# Altium schematic sheet [12] - IMX6_DDR3.SchDoc
size A2
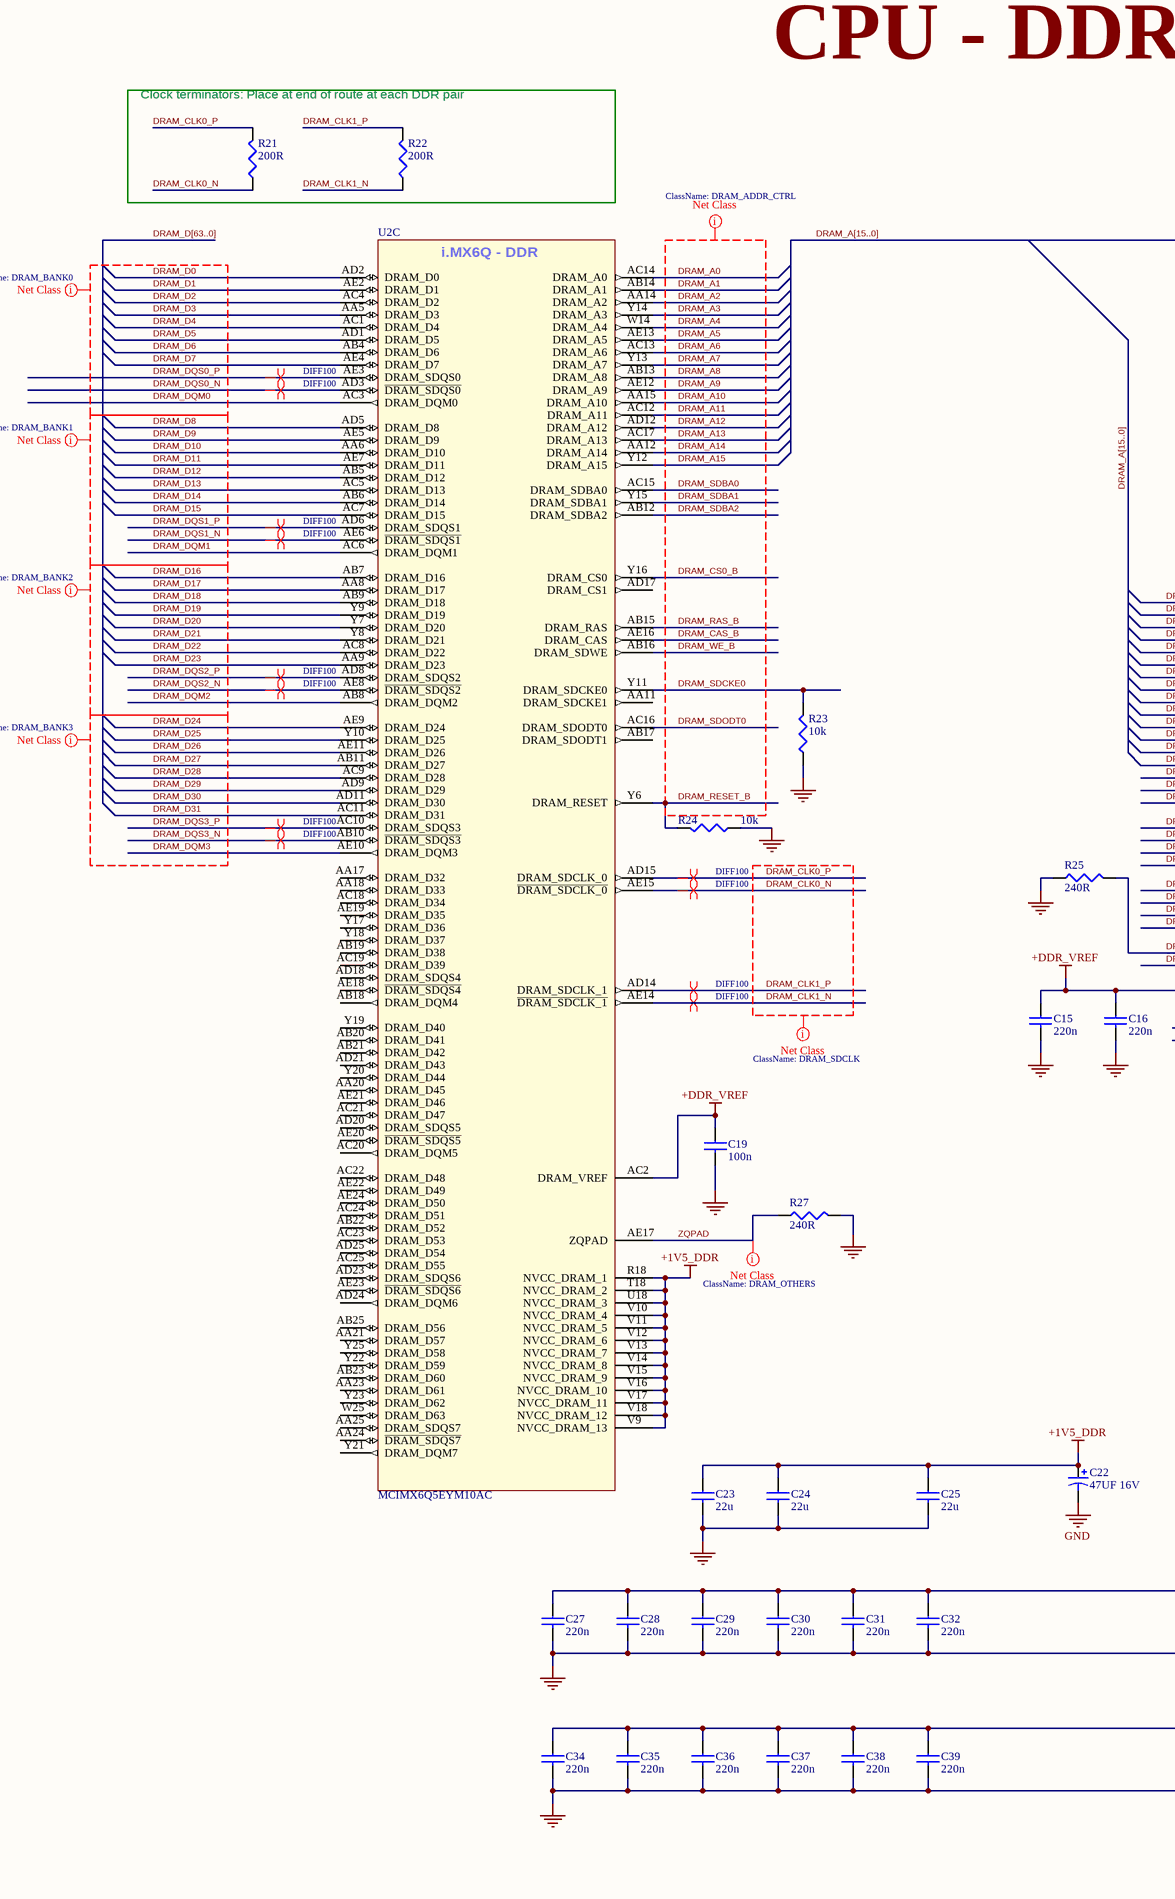
[diagram p0: [12] - IMX6_DDR3.SchDoc, left]
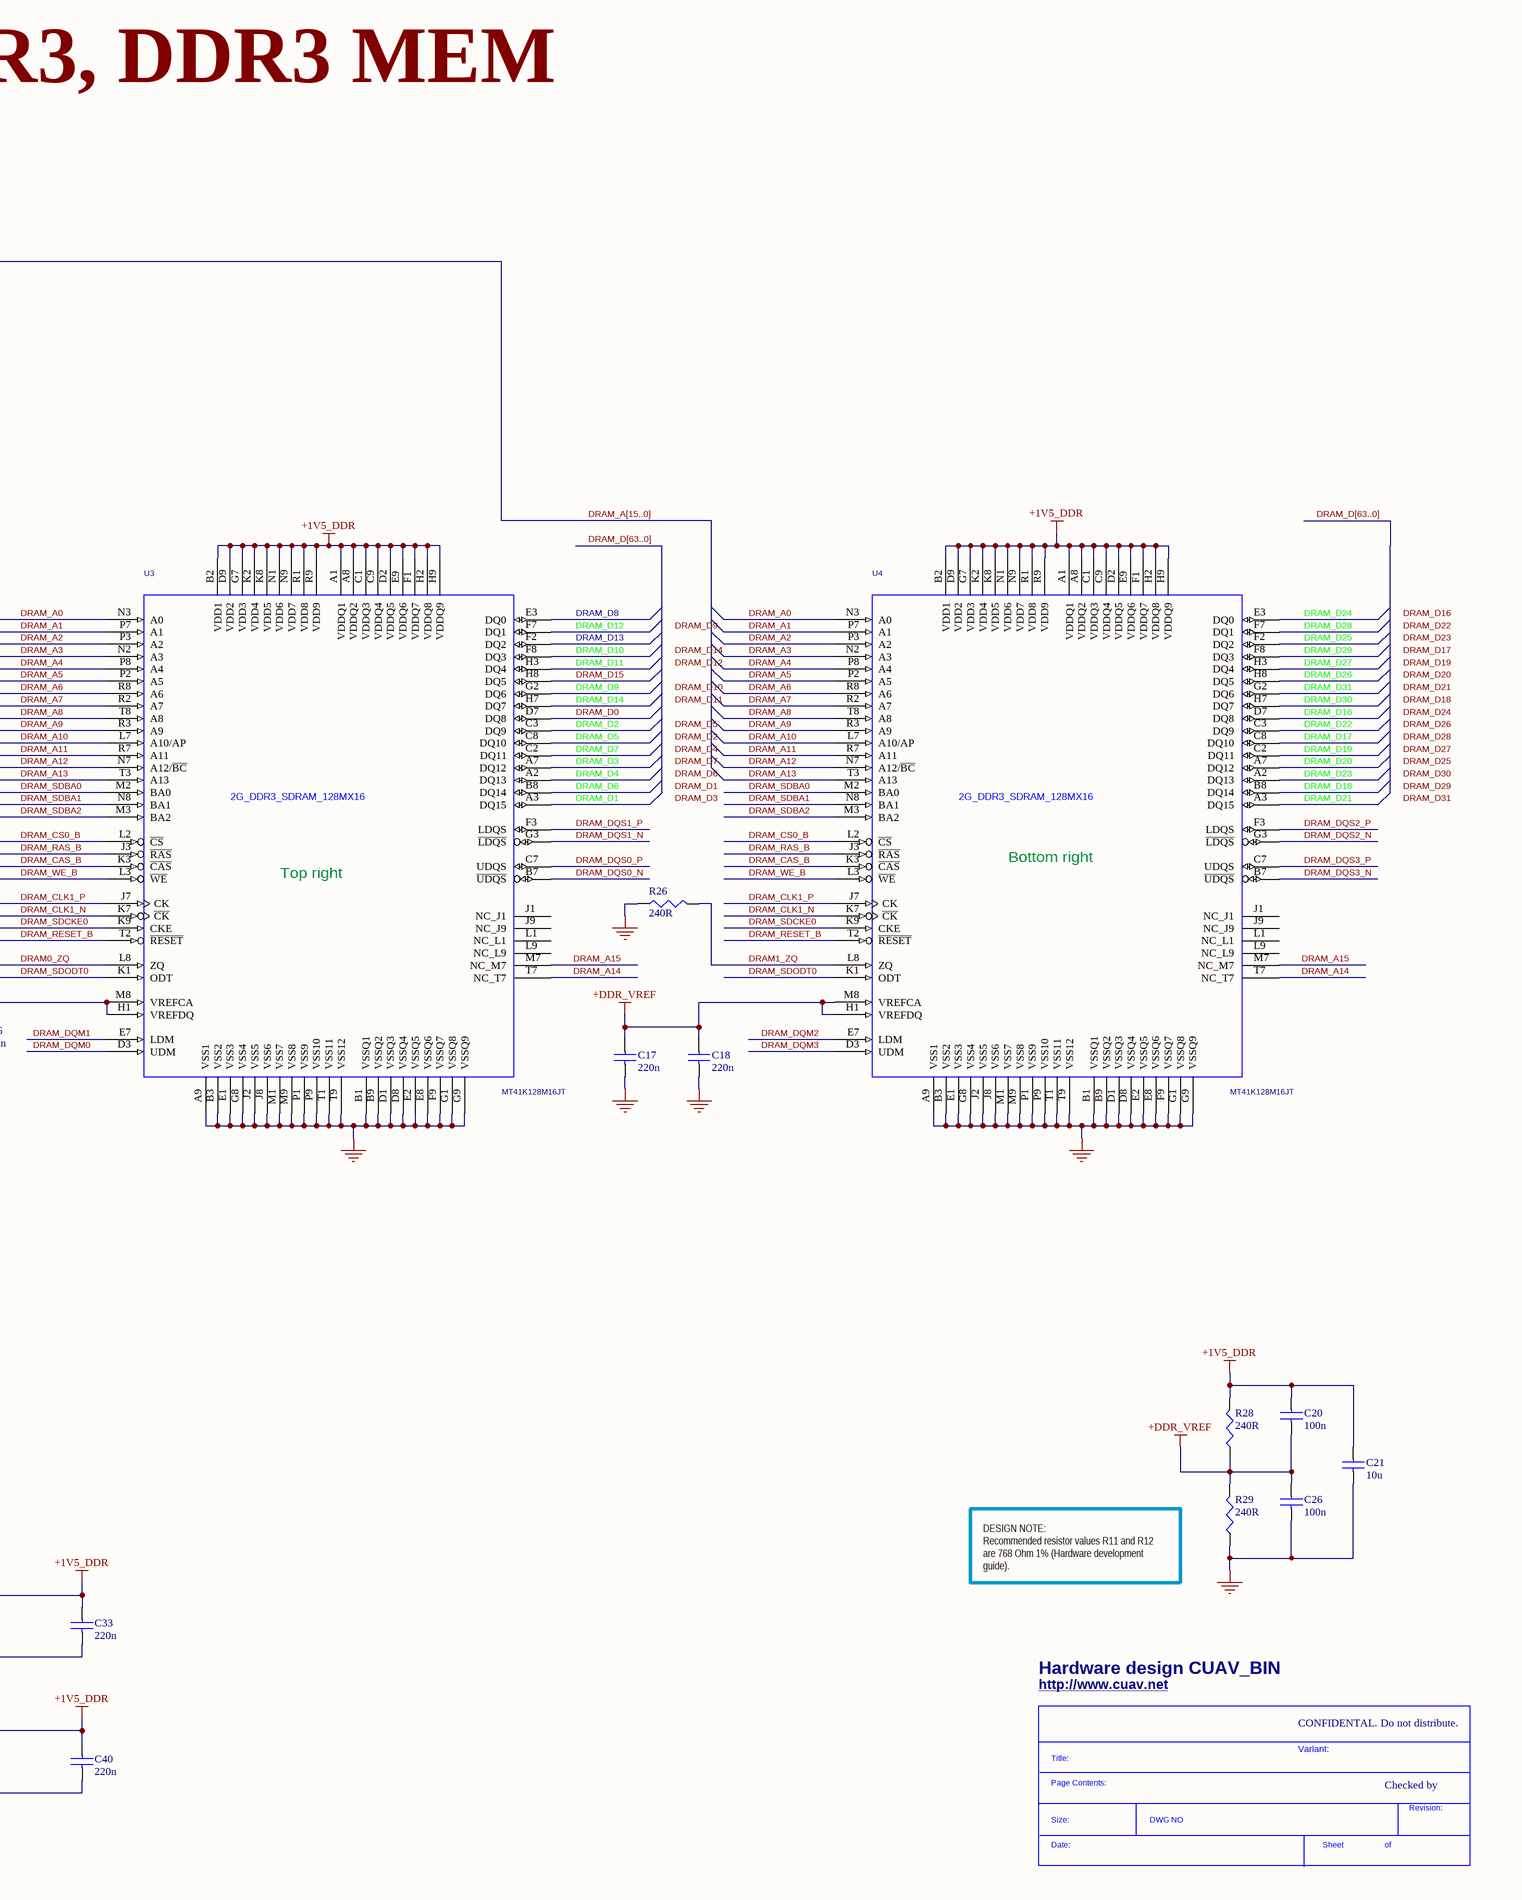
[diagram p1: [12] - IMX6_DDR3.SchDoc, right]

## Parts
*  SDTitleBlock  (value not drawn)  (graphical)
C15  220n  [0402CAP]
C16  220n  [0402CAP]
C17  220n  [0402CAP]
C18  220n  [0402CAP]
C19  100n  [C0402]
C20  100n  [0402CAP]
C21  10u  [C0603]
C22  47UF 16V  [7343CAP]
C23  22u  [C0603]
C24  22u  [C0603]
C25  22u  [C0603]
C26  100n  [0402CAP]
C27  220n  [0402CAP]
C28  220n  [0402CAP]
C29  220n  [0402CAP]
C30  220n  [0402CAP]
C31  220n  [0402CAP]
C32  220n  [0402CAP]
C33  220n  [0402CAP]
C34  220n  [0402CAP]
C35  220n  [0402CAP]
C36  220n  [0402CAP]
C37  220n  [0402CAP]
C38  220n  [0402CAP]
C39  220n  [0402CAP]
C40  220n  [0402CAP]
R21  200R  [R0402]
R22  200R  [R0402]
R23  10k  [R0402]
R24  10k  [R0402]
R25  240R  [R0402]
R26  240R  [R0402]
R27  240R  [R0402]
R28  240R  [R0402]
R29  240R  [R0402]
U2  MCIMX6Q5EYM10AC  [PBGA624]  (part C of 15)
U3  MT41K128M16JT  [96_FPGA_DD3]
U4  MT41K128M16JT  [96_FPGA_DD3]

## Blocks framed on the sheet
Clock terminators: Place at end of route at each DDR pair: R21 R22

## Nets
+1V5_DDR: C20.1 C21.1 C22.A C23.1 C24.1 C25.1 C27.1 C28.1 C29.1 C30.1 C31.1 C32.1 C33.1 C34.1 C35.1 C36.1 C37.1 C38.1 C39.1 C40.1 R28.2 U2.R18(NVCC_DRAM_1) U2.T18(NVCC_DRAM_2) U2.U18(NVCC_DRAM_3) U2.V9(NVCC_DRAM_13) U2.V10(NVCC_DRAM_4) U2.V11(NVCC_DRAM_5) U2.V12(NVCC_DRAM_6) U2.V13(NVCC_DRAM_7) U2.V14(NVCC_DRAM_8) U2.V15(NVCC_DRAM_9) U2.V16(NVCC_DRAM_10) U2.V17(NVCC_DRAM_11) U2.V18(NVCC_DRAM_12) U3.A1(VDDQ1) U3.A8(VDDQ2) U3.B2(VDD1) U3.C1(VDDQ3) U3.C9(VDDQ4) U3.D2(VDDQ5) U3.D9(VDD2) U3.E9(VDDQ6) U3.F1(VDDQ7) U3.G7(VDD3) U3.H2(VDDQ8) U3.H9(VDDQ9) U3.K2(VDD4) U3.K8(VDD5) U3.N1(VDD6) U3.N9(VDD7) U3.R1(VDD8) U3.R9(VDD9) U4.A1(VDDQ1) U4.A8(VDDQ2) U4.B2(VDD1) U4.C1(VDDQ3) U4.C9(VDDQ4) U4.D2(VDDQ5) U4.D9(VDD2) U4.E9(VDDQ6) U4.F1(VDDQ7) U4.G7(VDD3) U4.H2(VDDQ8) U4.H9(VDDQ9) U4.K2(VDD4) U4.K8(VDD5) U4.N1(VDD6) U4.N9(VDD7) U4.R1(VDD8) U4.R9(VDD9)
+DDR_VREF: C15.1 C16.1 C17.1 C18.1 C19.1 C20.2 C26.1 R28.1 R29.2 U2.AC2(DRAM_VREF) U3.H1(VREFDQ) U3.M8(VREFCA) U4.H1(VREFDQ) U4.M8(VREFCA)
GND: C15.2 C16.2 C17.2 C18.2 C19.2 C21.2 C22.C C23.2 C24.2 C25.2 C26.2 C27.2 C28.2 C29.2 C30.2 C31.2 C32.2 C33.2 C34.2 C35.2 C36.2 C37.2 C38.2 C39.2 C40.2 R23.1 R24.1 R25.1 R26.1 R27.2 R29.1 U3.A9(VSS1) U3.B1(VSSQ1) U3.B3(VSS2) U3.B9(VSSQ2) U3.D1(VSSQ3) U3.D8(VSSQ4) U3.E1(VSS3) U3.E2(VSSQ5) U3.E8(VSSQ6) U3.F9(VSSQ7) U3.G1(VSSQ8) U3.G8(VSS4) U3.G9(VSSQ9) U3.J2(VSS5) U3.J8(VSS6) U3.M1(VSS7) U3.M9(VSS8) U3.P1(VSS9) U3.P9(VSS10) U3.T1(VSS11) U3.T9(VSS12) U4.A9(VSS1) U4.B1(VSSQ1) U4.B3(VSS2) U4.B9(VSSQ2) U4.D1(VSSQ3) U4.D8(VSSQ4) U4.E1(VSS3) U4.E2(VSSQ5) U4.E8(VSSQ6) U4.F9(VSSQ7) U4.G1(VSSQ8) U4.G8(VSS4) U4.G9(VSSQ9) U4.J2(VSS5) U4.J8(VSS6) U4.M1(VSS7) U4.M9(VSS8) U4.P1(VSS9) U4.P9(VSS10) U4.T1(VSS11) U4.T9(VSS12)
DRAM0_ZQ: R25.2 U3.L8(ZQ)
DRAM1_ZQ: R26.2 U4.L8(ZQ)
DRAM_A0: U2.AC14(DRAM_A0) U3.N3(A0) U4.N3(A0)
DRAM_A1: U2.AB14(DRAM_A1) U3.P7(A1) U4.P7(A1)
DRAM_A2: U2.AA14(DRAM_A2) U3.P3(A2) U4.P3(A2)
DRAM_A3: U2.Y14(DRAM_A3) U3.N2(A3) U4.N2(A3)
DRAM_A4: U2.W14(DRAM_A4) U3.P8(A4) U4.P8(A4)
DRAM_A5: U2.AE13(DRAM_A5) U3.P2(A5) U4.P2(A5)
DRAM_A6: U2.AC13(DRAM_A6) U3.R8(A6) U4.R8(A6)
DRAM_A7: U2.Y13(DRAM_A7) U3.R2(A7) U4.R2(A7)
DRAM_A8: U2.AB13(DRAM_A8) U3.T8(A8) U4.T8(A8)
DRAM_A9: U2.AE12(DRAM_A9) U3.R3(A9) U4.R3(A9)
DRAM_A10: U2.AA15(DRAM_A10) U3.L7(A10/AP) U4.L7(A10/AP)
DRAM_A11: U2.AC12(DRAM_A11) U3.R7(A11) U4.R7(A11)
DRAM_A12: U2.AD12(DRAM_A12) U3.N7(A12/~{BC}) U4.N7(A12/~{BC})
DRAM_A13: U2.AC17(DRAM_A13) U3.T3(A13) U4.T3(A13)
DRAM_A14: U2.AA12(DRAM_A14) U3.T7(NC_T7) U4.T7(NC_T7)
DRAM_A15: U2.Y12(DRAM_A15) U3.M7(NC_M7) U4.M7(NC_M7)
DRAM_CAS_B: U2.AE16(DRAM_CAS) U3.K3(~{CAS}) U4.K3(~{CAS})
DRAM_CLK0_N: R21.1 U2.AE15(~{DRAM_SDCLK_0})
DRAM_CLK0_P: R21.2 U2.AD15(DRAM_SDCLK_0)
DRAM_CLK1_N: R22.1 U2.AE14(~{DRAM_SDCLK_1}) U3.K7(~{CK}) U4.K7(~{CK})
DRAM_CLK1_P: R22.2 U2.AD14(DRAM_SDCLK_1) U3.J7(CK) U4.J7(CK)
DRAM_CS0_B: U2.Y16(DRAM_CS0) U3.L2(~{CS}) U4.L2(~{CS})
DRAM_D0: U2.AD2(DRAM_D0) U3.D7(DQ8)
DRAM_D1: U2.AE2(DRAM_D1) U3.A3(DQ15)
DRAM_D2: U2.AC4(DRAM_D2) U3.C3(DQ9)
DRAM_D3: U2.AA5(DRAM_D3) U3.A7(DQ12)
DRAM_D4: U2.AC1(DRAM_D4) U3.A2(DQ13)
DRAM_D5: U2.AD1(DRAM_D5) U3.C8(DQ10)
DRAM_D6: U2.AB4(DRAM_D6) U3.B8(DQ14)
DRAM_D7: U2.AE4(DRAM_D7) U3.C2(DQ11)
DRAM_D8: U2.AD5(DRAM_D8) U3.E3(DQ0)
DRAM_D9: U2.AE5(DRAM_D9) U3.G2(DQ6)
DRAM_D10: U2.AA6(DRAM_D10) U3.F8(DQ3)
DRAM_D11: U2.AE7(DRAM_D11) U3.H3(DQ4)
DRAM_D12: U2.AB5(DRAM_D12) U3.F7(DQ1)
DRAM_D13: U2.AC5(DRAM_D13) U3.F2(DQ2)
DRAM_D14: U2.AB6(DRAM_D14) U3.H7(DQ7)
DRAM_D15: U2.AC7(DRAM_D15) U3.H8(DQ5)
DRAM_D16: U2.AB7(DRAM_D16) U4.D7(DQ8)
DRAM_D17: U2.AA8(DRAM_D17) U4.C8(DQ10)
DRAM_D18: U2.AB9(DRAM_D18) U4.B8(DQ14)
DRAM_D19: U2.Y9(DRAM_D19) U4.C2(DQ11)
DRAM_D20: U2.Y7(DRAM_D20) U4.A7(DQ12)
DRAM_D21: U2.Y8(DRAM_D21) U4.A3(DQ15)
DRAM_D22: U2.AC8(DRAM_D22) U4.C3(DQ9)
DRAM_D23: U2.AA9(DRAM_D23) U4.A2(DQ13)
DRAM_D24: U2.AE9(DRAM_D24) U4.E3(DQ0)
DRAM_D25: U2.Y10(DRAM_D25) U4.F2(DQ2)
DRAM_D26: U2.AE11(DRAM_D26) U4.H8(DQ5)
DRAM_D27: U2.AB11(DRAM_D27) U4.H3(DQ4)
DRAM_D28: U2.AC9(DRAM_D28) U4.F7(DQ1)
DRAM_D29: U2.AD9(DRAM_D29) U4.F8(DQ3)
DRAM_D30: U2.AD11(DRAM_D30) U4.H7(DQ7)
DRAM_D31: U2.AC11(DRAM_D31) U4.G2(DQ6)
DRAM_DQM0: U2.AC3(DRAM_DQM0) U3.D3(UDM)
DRAM_DQM1: U2.AC6(DRAM_DQM1) U3.E7(LDM)
DRAM_DQM2: U2.AB8(DRAM_DQM2) U4.E7(LDM)
DRAM_DQM3: U2.AE10(DRAM_DQM3) U4.D3(UDM)
DRAM_DQS0_N: U2.AD3(~{DRAM_SDQS0}) U3.B7(~{UDQS})
DRAM_DQS0_P: U2.AE3(DRAM_SDQS0) U3.C7(UDQS)
DRAM_DQS1_N: U2.AE6(~{DRAM_SDQS1}) U3.G3(~{LDQS})
DRAM_DQS1_P: U2.AD6(DRAM_SDQS1) U3.F3(LDQS)
DRAM_DQS2_N: U2.AE8(~{DRAM_SDQS2}) U4.G3(~{LDQS})
DRAM_DQS2_P: U2.AD8(DRAM_SDQS2) U4.F3(LDQS)
DRAM_DQS3_N: U2.AB10(~{DRAM_SDQS3}) U4.B7(~{UDQS})
DRAM_DQS3_P: U2.AC10(DRAM_SDQS3) U4.C7(UDQS)
DRAM_RAS_B: U2.AB15(DRAM_RAS) U3.J3(~{RAS}) U4.J3(~{RAS})
DRAM_RESET_B: R24.2 U2.Y6(DRAM_RESET) U3.T2(~{RESET}) U4.T2(~{RESET})
DRAM_SDBA0: U2.AC15(DRAM_SDBA0) U3.M2(BA0) U4.M2(BA0)
DRAM_SDBA1: U2.Y15(DRAM_SDBA1) U3.N8(BA1) U4.N8(BA1)
DRAM_SDBA2: U2.AB12(DRAM_SDBA2) U3.M3(BA2) U4.M3(BA2)
DRAM_SDCKE0: R23.2 U2.Y11(DRAM_SDCKE0) U3.K9(CKE) U4.K9(CKE)
DRAM_SDODT0: U2.AC16(DRAM_SDODT0) U3.K1(ODT) U4.K1(ODT)
DRAM_WE_B: U2.AB16(DRAM_SDWE) U3.L3(~{WE}) U4.L3(~{WE})
ZQPAD: R27.1 U2.AE17(ZQPAD)

Not connected (* = marked no-connect by the designer): U2 AA11(DRAM_SDCKE1) AA17(DRAM_D32) AA18(DRAM_D33) AA20(DRAM_D45) AA21(DRAM_D57) AA23(DRAM_D61) AA24(~{DRAM_SDQS7}) AA25(DRAM_SDQS7) AB17(DRAM_SDODT1) AB18(DRAM_DQM4) AB19(DRAM_D38) AB20(DRAM_D41) AB21(DRAM_D42) AB22(DRAM_D52) AB23(DRAM_D60) AB25(DRAM_D56) AC18(DRAM_D34) AC19(DRAM_D39) AC20(DRAM_DQM5) AC21(DRAM_D47) AC22(DRAM_D48) AC23(DRAM_D53) AC24(DRAM_D51) AC25(DRAM_D55) AD17(DRAM_CS1) AD18(DRAM_SDQS4) AD20(DRAM_SDQS5) AD21(DRAM_D43) AD23(DRAM_SDQS6) AD24(DRAM_DQM6) AD25(DRAM_D54) AE18(~{DRAM_SDQS4}) AE19(DRAM_D35) AE20(~{DRAM_SDQS5}) AE21(DRAM_D46) AE22(DRAM_D49) AE23(~{DRAM_SDQS6}) AE24(DRAM_D50) W25(DRAM_D63) Y17(DRAM_D36) Y18(DRAM_D37) Y19(DRAM_D40) Y20(DRAM_D44) Y21(DRAM_DQM7) Y22(DRAM_D59) Y23(DRAM_D62) Y25(DRAM_D58); U3 J1(NC_J1) J9(NC_J9) L1(NC_L1) L9(NC_L9); U4 J1(NC_J1) J9(NC_J9) L1(NC_L1) L9(NC_L9)

## Buses and harness runs
bus DRAM_A[15..0]
bus DRAM_D[63..0]

## Layout directives
net class DRAM_BANK0: DRAM_D0, DRAM_D1, DRAM_D2, DRAM_D3, DRAM_D4, DRAM_D5, DRAM_D6, DRAM_D7, DRAM_DQM0, DRAM_DQS0_N, DRAM_DQS0_P
net class DRAM_BANK1: DRAM_D8, DRAM_D9, DRAM_D10, DRAM_D11, DRAM_D12, DRAM_D13, DRAM_D14, DRAM_D15, DRAM_DQM1, DRAM_DQS1_N, DRAM_DQS1_P
net class DRAM_BANK2: DRAM_D16, DRAM_D17, DRAM_D18, DRAM_D19, DRAM_D20, DRAM_D21, DRAM_D22, DRAM_D23, DRAM_DQM2, DRAM_DQS2_N, DRAM_DQS2_P
net class DRAM_BANK3: DRAM_D24, DRAM_D25, DRAM_D26, DRAM_D27, DRAM_D28, DRAM_D29, DRAM_D30, DRAM_D31, DRAM_DQM3, DRAM_DQS3_N, DRAM_DQS3_P
differential pair; net class DIFF100: DRAM_CLK0_N, DRAM_CLK0_P, DRAM_CLK1_N, DRAM_CLK1_P, DRAM_DQS0_N, DRAM_DQS0_P, DRAM_DQS1_N, DRAM_DQS1_P, DRAM_DQS2_N, DRAM_DQS2_P, DRAM_DQS3_N, DRAM_DQS3_P
net class DRAM_ADDR_CTRL: DRAM_A0, DRAM_A1, DRAM_A2, DRAM_A3, DRAM_A4, DRAM_A5, DRAM_A6, DRAM_A7, DRAM_A8, DRAM_A9, DRAM_A10, DRAM_A11, DRAM_A12, DRAM_A13, DRAM_A14, DRAM_A15, DRAM_CAS_B, DRAM_CS0_B, DRAM_RAS_B, DRAM_RESET_B, DRAM_SDBA0, DRAM_SDBA1, DRAM_SDBA2, DRAM_SDCKE0, DRAM_SDODT0, DRAM_WE_B
net class DRAM_SDCLK: DRAM_CLK0_N, DRAM_CLK0_P, DRAM_CLK1_N, DRAM_CLK1_P
net class DRAM_OTHERS: ZQPAD

## Notes on the sheet
- CPU - DDR3, DDR3 MEM
- (near U3) Top right
- (near U4) Bottom right
- DESIGN NOTE:
  Recommended resistor values R11 and R12 are 768 Ohm 1% (Hardware development guide).
- (near *) Hardware design CUAV_BIN
- (near *) http://www.cuav.net
- CONFIDENTAL. Do not distribute.
- Variant:
- Checked by
- Labels drawn without touching a wire or pin: DRAM_D1, DRAM_D2, DRAM_D3, DRAM_D4, DRAM_D5, DRAM_D6, DRAM_D7, DRAM_D9, DRAM_D10, DRAM_D11, DRAM_D12, DRAM_D14, DRAM_D16, DRAM_D17, DRAM_D18, DRAM_D19, DRAM_D20, DRAM_D21, DRAM_D22, DRAM_D23, DRAM_D24, DRAM_D25, DRAM_D26, DRAM_D27, DRAM_D28, DRAM_D29, DRAM_D30, DRAM_D31
- (in symbol 2G_DDR3_SDRAM_128MX16_96P) 2G_DDR3_SDRAM_128MX16
- (in symbol MCIMX6Q5EYM10AC, part C) i.MX6Q - DDR
- (in symbol SDTitleBlock) Title:; Page Contents:; Revision:; Size:; DWG NO; Date:; Sheet; of

## Library data of the parts
C15-C18 C27-C40 = C1005X5R1E224M: CAP CER .22UF 25V X5R 20% 0402; Manufacturer: TDK Corporation; Capacitance: 0.22礔; Value: 220nF; .Checked PCB: used; Tolerance: ?0%; Category: Capacitors; Supplier Part Number: 445-5945-1-ND; Manufacturer Part Number: C1005X5R1E224M; Operating Temperature: -55癈 ~ 85癈; Package / Case: 0402 (1005 Metric); Price 1k [$]: 0.02600; .Checked SCH: used; Voltage - Rated: 25V; Supplier: Digikey; Supplier 1: Digi-Key; Supplier Part Number 1: 445-5945-1-ND; RoHS: RoHS Compliant; Stock 1: 54593; Pricing 1: 1=0.3, 10=0.2, 100=0.08, 250=0.05752, 500=0.041, 1000=0.03 (USD); Temperature Coefficient: X5R; Mounting Type: Surface Mount, MLCC; Applications: General Purpose; Ratings: -; Size / Dimension: 0.039" L x 0.020" W (1.00mm x 0.50mm); Height - Seated (Max): -; Thickness (Max): 0.022" (0.55mm); Lead Spacing: -; Features: -; Packaging: Cut Tape (CT); Lead Style: -; ComponentLink1URL: http://www.tdk.co.jp/tefe02/e412_c.pdf; ComponentLink1Description: http://www.tdk.co.jp/tefe02/e412_c.pdf
C19 C20 C26 = C1005X5R1H104K: CAP CER .10UF 50V X5R 10% 0402; Manufacturer: TDK Corporation; Capacitance: 0.1礔; Value: 100nF; .Checked PCB: used; Tolerance: ?0%; Category: Capacitors; Supplier Part Number: 445-5942-1-ND; Manufacturer Part Number: C1005X5R1H104K; Operating Temperature: -55癈 ~ 85癈; Package / Case: 0402 (1005 Metric); Price 1k [$]: 0.02340; .Checked SCH: used; Voltage - Rated: 50V; Supplier: Digikey; Supplier 1: Digi-Key; Supplier Part Number 1: 445-5942-1-ND; RoHS: RoHS Compliant; Stock 1: 106926; Pricing 1: 1=0.27, 10=0.18, 100=0.072, 250=0.05176, 500=0.0369, 1000=0.027 (USD); Temperature Coefficient: X5R; Mounting Type: Surface Mount, MLCC; Applications: General Purpose; Ratings: -; Size / Dimension: 0.039" L x 0.020" W (1.00mm x 0.50mm); Height - Seated (Max): -; Thickness (Max): 0.022" (0.55mm); Lead Spacing: -; Features: -; Packaging: Cut Tape (CT); Lead Style: -; ComponentLink1URL: http://www.tdk.co.jp/tefe02/e412_c.pdf; ComponentLink1Description: http://www.tdk.co.jp/tefe02/e412_c.pdf
C21 = C1608X5R0J106M: CAP CER 10UF 6.3V X5R 20% 0603; Manufacturer: TDK Corporation; Capacitance: 10礔; Value: 10礔; .Checked PCB: used; Tolerance: ?0%; Category: Capacitors; Supplier Part Number: 445-4112-1-ND; Manufacturer Part Number: C1608X5R0J106M; Operating Temperature: -55癈 ~ 85癈; Package / Case: 0603 (1608 Metric); Price 1k [$]: 0.08580; .Checked SCH: used; Voltage - Rated: 6.3V; Features: Low ESR; Supplier: Digikey; Supplier 1: Digi-Key; Supplier Part Number 1: 445-4112-1-ND; RoHS: RoHS Compliant; Stock 1: 48157; Pricing 1: 1=0.46, 10=0.363, 100=0.1898, 250=0.14024, 500=0.1089, 1000=0.0858 (USD); Temperature Coefficient: X5R; Mounting Type: Surface Mount, MLCC; Applications: General Purpose; Ratings: -; Size / Dimension: 0.063" L x 0.031" W (1.60mm x 0.80mm); Height - Seated (Max): -; Thickness (Max): 0.037" (0.95mm); Lead Spacing: -; Packaging: Cut Tape (CT); Lead Style: -; ComponentLink1URL: http://www.tdk.com/pdf/general_B11.pdf; ComponentLink1Description: http://www.tdk.com/pdf/general_B11.pdf
C22 = Cap Pol1: Polarized Capacitor (Radial); Value: 100pF; Published: 8-Jun-2000; LatestRevisionDate: 17-Jul-2002; LatestRevisionNote: Re-released for DXP Platform.; PackageReference: RB7.6-15; Publisher: Altium Limited; PackageDescription: Polarized Capacitor (Radial); 2 Leads
C23-C25 = GRM188R60G226MEA0L: CAP CER 22UF 4V 20% X5R 0603; Manufacturer: Murata Electronics North America; Capacitance: 22礔; Tolerance: ?0%; .Checked PCB: RF, used by MM; .Checked SCH: MM, checked by RF; .Creator: MM; Supplier 1: Digi-Key; Supplier Part Number 1: 490-5526-1-ND; Manufacturer Part Number: GRM188R60G226MEA0L; RoHS: RoHS Compliant; Category: Capacitors; Stock 1: 5760; Pricing 1: 1=0.79, 10=0.663, 50=0.4752, 100=0.4158, 250=0.32672, 500=0.297, 1000=0.2376 (USD); Voltage - Rated: 4V; Temperature Coefficient: X5R; Mounting Type: Surface Mount, MLCC; Operating Temperature: -55癈 ~ 85癈; Applications: General Purpose; Ratings: -; Package / Case: 0603 (1608 Metric); Size / Dimension: 0.063" L x 0.031" W (1.60mm x 0.80mm); Height - Seated (Max): -; Thickness (Max): 0.035" (0.90mm); Lead Spacing: -; Features: -; Packaging: Cut Tape (CT); Lead Style: -; ComponentLink1URL: http://www.murata.com/products/catalog/pdf/c02e.pdf; ComponentLink1Description: http://www.murata.com/products/catalog/pdf/c02e.pdf
R21 R22 = CRCW0402200RFKED: RES 200 OHM 1/16W 1% 0402 SMD; Manufacturer: Vishay Dale; Resistance (Ohms): 200; Power (Watts): 0.063W, 1/16W; Temperature Coefficient: ?00ppm/癈; Tolerance: ?%; .Checked PCB: RF, used by MM; .Checked SCH: MM, checked by RF; .Creator: MM; Supplier 1: Digi-Key; Manufacturer Part Number: CRCW0402200RFKED; RoHS: RoHS Compliant; Category: Resistors; Stock 1: 251574; Pricing 1: 10=0.083, 50=0.0444, 200=0.0255, 1000=0.0174 (USD); Composition: Thick Film; Features: Automotive AEC-Q200 Qualified; Package / Case: 0402 (1005 Metric); Supplier Device Package: 0402 (1005 Metric); Size / Dimension: 0.039" L x 0.020" W (1.00mm x 0.50mm); Height: 0.016" (0.40mm); Number of Terminations: 2; Packaging: Cut Tape (CT); ComponentLink1URL: http://www.vishay.com/doc?20035; ComponentLink1Description: http://www.vishay.com/doc?20035; Supplier Part Number 1: 541-200LCT-ND
R23 R24 = RC0402FR-0710KL: RES 10.0K OHM 1/16W 1% 0402 SMD; Manufacturer: Yageo; Power (Watts): 0.063W, 1/16W; Tolerance: ?%; .Checked PCB: used; Temperature Coefficient: ?00ppm/癈; Category: Resistors; Supplier Part Number: 311-10.0KLRCT-ND; Manufacturer Part Number: RC0402FR-0710KL; Package / Case: 0402 (1005 Metric); Price 1k [$]: 0.01421; Resistance (Ohms): 10K; Value: 10k; .Checked SCH: used; Supplier: Digikey; Supplier 1: Digi-Key; Supplier Part Number 1: 311-10.0KLRCT-ND; RoHS: RoHS Compliant; Stock 1: 2916495; Pricing 1: 10=0.014, 50=0.0104, 100=0.0079, 250=0.00584, 500=0.00432, 1000=0.00288 (USD); Composition: Thick Film; Features: -; Size / Dimension: 0.039" L x 0.020" W (1.00mm x 0.50mm); Height: 0.016" (0.40mm); Number of Terminations: 2; Packaging: Cut Tape (CT); ComponentLink1URL: http://www.yageo.com/documents/recent/PYu-RC0402_51_RoHS_L_6.pdf; ComponentLink1Description: http://www.yageo.com/documents/recent/PYu-RC0402_51_RoHS_L_6.pdf
R25-R29 = RMCF0402FT240R: RES TF 240 OHM 1% 0.0625W 0402; Manufacturer: Stackpole Electronics Inc; Resistance (Ohms): 240; Power (Watts): 0.063W, 1/16W; Tolerance: ?%; .Checked PCB: used; Temperature Coefficient: ?00ppm/癈; Category: Resistors; Supplier Part Number: RMCF0402FT240RCT-ND; Manufacturer Part Number: RMCF0402FT240R; Package / Case: 0402 (1005 Metric); Price 1k [$]: 0.00384; Value: 240R; .Checked SCH: used; Supplier: Digikey; Supplier 1: Digi-Key; Supplier Part Number 1: RMCF0402FT240RCT-ND; RoHS: RoHS Compliant; Stock 1: 39860; Pricing 1: 1=0.04, 10=0.025, 50=0.0138, 100=0.0105, 250=0.0078, 500=0.00576, 1000=0.00384 (USD); Composition: Thick Film; Features: -; Size / Dimension: 0.039" L x 0.020" W (1.00mm x 0.50mm); Height: 0.016" (0.40mm); Number of Terminations: 2; Packaging: Cut Tape (CT); ComponentLink1URL: http://www.seielect.com/Catalog/SEI-RMCF.pdf; ComponentLink1Description: http://www.seielect.com/Catalog/SEI-RMCF.pdf
U2 = MCIMX6Q5EYM10AC: IC MCU 32BIT ARM QUAD 624FCBGA; Manufacturer: Freescale Semiconductor; Core Processor: ARM?Cortex?A9; Core Size: 32-Bit Quad-Core; Speed: 1.0GHz; Connectivity: CAN, EBI/EMI, ESAI, Ethernet, GPMI, I2C, MMC/SD, PCI, SATA, SPI, UART, USB, USB OTG; Peripherals: DMA, HDMI, I2S/SSI/AC97, MIPI CSI, MIMI DSI, MIPI HIS, PWM, WDT; Number of I /O: 224; Program Memory Type: External Program Memory; RAM Size: 256K x 8; Voltage - Supply (Vcc/Vdd): 0.925 V ~ 1.5 V; Oscillator Type: Internal; .Creator: MM; .Checked PCB: MM, checked by RF; Supplier 1: Digi-Key; Manufacturer Part Number: MCIMX6Q5EYM10AC; RoHS: RoHS Compliant; Category: Integrated Circuits (ICs); Stock 1: 0; Pricing 1: 1=54.98, 10=51.922, 25=48.868, 100=30.5424 (USD); Program Memory Size: -; EEPROM Size: -; Data Converters: -; Operating Temperature: -20癈 ~ 105癈; Package / Case: 624-FBGA, FCBGA; Packaging: Tray; ComponentLink1URL: http://cache.freescale.com/files/32bit/doc/data_sheet/IMX6DQCEC.pdf; ComponentLink1Description: http://cache.freescale.com/files/32bit/doc/data_sheet/IMX6DQCEC.pdf; Supplier Part Number 1: MCIMX6Q5EYM10AC-ND; .Checked SCH: MM
U3 U4 = 2G_DDR3_SDRAM_128MX16_96P: IC MEM DDR3 SDRAM 2Gb 128MX16 1.35V FBGA96; AGILE_PN: 334-77489; MFG_NAME01: MICRON; MFG_PN01: MT41K128M16JT-125:K; CAD_APPROVED: Yes; CLASS: IC; ROHS: Yes; HEIGHT: 1.2 MM